# Altium schematic sheet DE-061116.SchDoc: Do Not Disturb Modul
size A4; Author: eldar6776@hotmail.com; DrawnBy: Eldar Dedic; Organization: I-MEDIA Group d.o.o; Address1: Topal Osman Paše 18; Address2: 71000 Sarajevo; Address3: Federacija BiH; Address4: Bosna i Hercegovina; DocumentNumber: DE-061116; Revision: 001; SheetNumber: 1; SheetTotal: 1; DocumentName: Do Not Disturb Hotel Modul; ProjectName: DE-061116
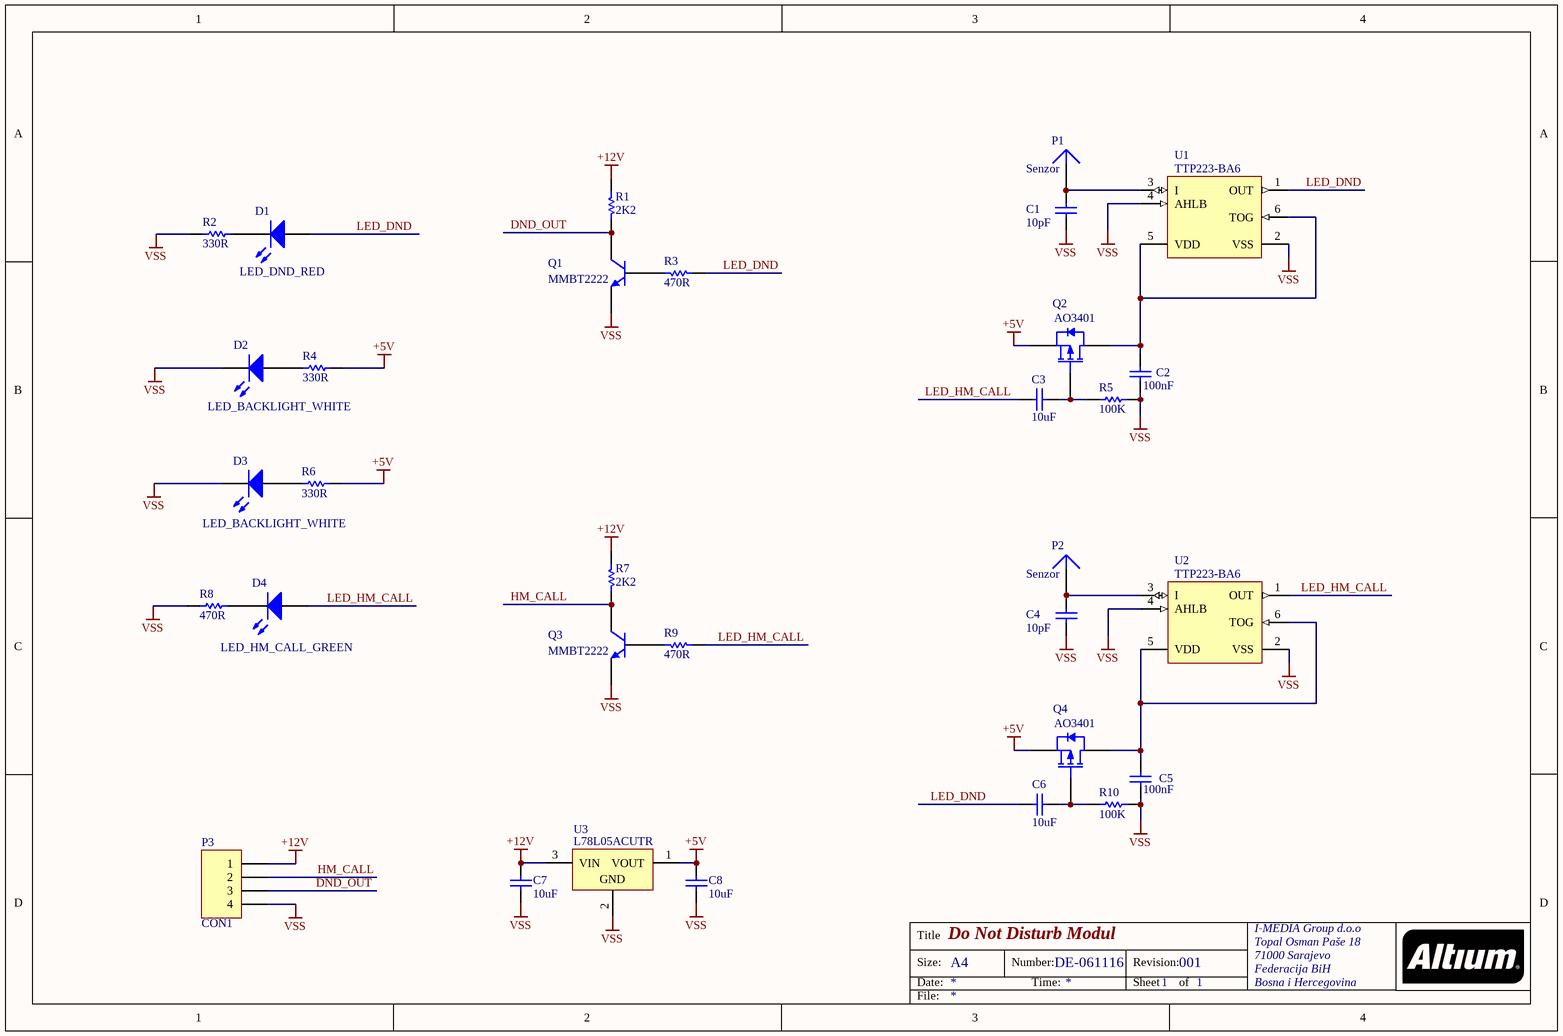
[diagram p0: DE-061116.SchDoc]

## Parts
C1  10pF  [0603]
C2  100nF  [0603]
C3  10uF  [0805]
C4  10pF  [0603]
C5  100nF  [0603]
C6  10uF  [0805]
C7  10uF  [0805]
C8  10uF  [0805]
D1  LED_DND_RED  [2.0X1.25X1.2]
D2  LED_BACKLIGHT_WHITE  [2.0X1.25X1.2]
D3  LED_BACKLIGHT_WHITE  [2.0X1.25X1.2]
D4  LED_HM_CALL_GREEN  [2.0X1.25X1.2]
P1  Senzor  [PIN1]
P2  Senzor  [PIN1]
P3  CON1  [HDR1X4]
Q1  MMBT2222  [SOT23_N]
Q2  AO3401  [SOT23_N]
Q3  MMBT2222  [SOT23_N]
Q4  AO3401  [SOT23_N]
R1  2K2  [ERA-0603]
R2  330R  [ERA-0603]
R3  470R  [ERA-0603]
R4  330R  [ERA-0603]
R5  100K  [ERA-0603]
R6  330R  [ERA-0603]
R7  2K2  [ERA-0603]
R8  470R  [ERA-0603]
R9  470R  [ERA-0603]
R10  100K  [ERA-0603]
U1  TTP223-BA6  [6ST1_N]
U2  TTP223-BA6  [6ST1_N]
U3  L78L05ACUTR  [SOT-89_N]

## Nets
+5V: C8.2 Q2.2(S) Q4.2(S) R4.1 R6.1 U3.1(VOUT)
+12V: C7.2 P3.1 R1.1 R7.1 U3.3(VIN)
VSS: C1.2 C2.1 C4.2 C5.1 C7.1 C8.1 D2.2(K) D3.2(K) P3.4 Q1.2(E) Q3.2(E) R2.2 R5.1 R8.2 R10.1 U1.2(VSS) U1.4(AHLB) U2.2(VSS) U2.4(AHLB) U3.2(GND)
DND_OUT: P3.3 Q1.3(C) R1.2
HM_CALL: P3.2 Q3.3(C) R7.2
LED_DND: C6.1 D1.1(A) R3.2 U1.1(OUT)
LED_HM_CALL: C3.1 D4.1(A) R9.2 U2.1(OUT)
NetC1_1: C1.1 P1.1 U1.3(I)
NetC2_2: C2.2 Q2.3(D) U1.5(VDD) U1.6(TOG)
NetC3_2: C3.2 Q2.1(G) R5.2
NetC4_1: C4.1 P2.1 U2.3(I)
NetC5_2: C5.2 Q4.3(D) U2.5(VDD) U2.6(TOG)
NetC6_2: C6.2 Q4.1(G) R10.2
NetD1_2: D1.2(K) R2.1
NetD2_1: D2.1(A) R4.2
NetD3_1: D3.1(A) R6.2
NetD4_2: D4.2(K) R8.1
NetQ1_1: Q1.1(B) R3.1
NetQ3_1: Q3.1(B) R9.1

## Notes on the sheet
- Title
- Size:
- Date:
- A4
- Number:
- Time:
- Revision:
- Sheet
- of
- File:

## Library data of the parts
C1 C4 = C0603: Ceramic Chip Capacitor - Standard; Note: Footprint corresponds to dimensions for bulk cassette packaging. This case size has tightened tolerances.; Value: 22pF; Published: 17-Jul-2002; LatestRevisionDate: 19-Mar-2004; LatestRevisionNote: Silkscreen size reduced.; DatasheetDocument: Mar-2001; PackageDocument: Mar-2001; PackageReference: 0603; Publisher: Altium Limited; Code_JEITA: 0603; Code_IPC: 1608 [0603]; ComponentLink1Description: Manufacturer Link; ComponentLink1URL: http://www.kemet.com/; ComponentLink2Description: Datasheet; ComponentLink2URL: http://www.kemet.com/kemet/web/homepage/kechome.nsf/vapubfilesname/F3102TA.pdf/$file/F3102TA.pdf
C2 C5 = C0603: Ceramic Chip Capacitor - Standard; Note: Footprint corresponds to dimensions for bulk cassette packaging. This case size has tightened tolerances.; Published: 17-Jul-2002; LatestRevisionDate: 19-Mar-2004; LatestRevisionNote: Silkscreen size reduced.; DatasheetDocument: Mar-2001; PackageDocument: Mar-2001; PackageReference: 0603; Publisher: Altium Limited; Code_JEITA: 0603; Code_IPC: 1608 [0603]; ComponentLink1Description: Manufacturer Link; ComponentLink1URL: http://www.kemet.com/; ComponentLink2Description: Datasheet; ComponentLink2URL: http://www.kemet.com/kemet/web/homepage/kechome.nsf/vapubfilesname/F3102TA.pdf/$file/F3102TA.pdf; Value: 100nF
C3 C6-C8 = C0805: Ceramic Chip Capacitor - Standard; Note: Footprint corresponds to dimensions for bulk cassette packaging. This case size has tightened tolerances.; Published: 17-Jul-2002; LatestRevisionDate: 19-Mar-2004; LatestRevisionNote: Silkscreen size reduced.; DatasheetDocument: Mar-2001; PackageDocument: Mar-2001; PackageReference: 0805; Publisher: Altium Limited; Code_JEITA: 0805; Code_IPC: 2012[0805]; ComponentLink1Description: Manufacturer Link; ComponentLink1URL: http://www.kemet.com/; ComponentLink2Description: Datasheet; ComponentLink2URL: http://www.kemet.com/kemet/web/homepage/kechome.nsf/vapubfilesname/F3102TA.pdf/$file/F3102TA.pdf; Value: 10uF
D1-D4 = HSMC-C540-F0001: Top Mount AS AlInGaP Red Oval Lens High Brightness; LuminousIntensity: 96mcd (Minimum).; PCB_Layout: Complies with manufacturer's recommendation.; Published: 11-Dec-2002; DatasheetDocument: 7-Mar-2002; PackageDocument: 30-Apr-2002; PackageReference: 2.0X1.25X1.2; Publisher: Altium Limited; LED_Colour: Red; ComponentLink1Description: Manufacturer Link; ComponentLink1URL: http://www.agilent.com/; ComponentLink2Description: Datasheet; ComponentLink2URL: http://cp.literature.agilent.com/litweb/pdf/5988-5794EN.pdf
P1 P2 = Plug: LatestRevisionDate: 17-Jul-2002; LatestRevisionNote: Re-released for DXP Platform.; Publisher: Altium Limited
P3 = Header 4: Header, 4-Pin; LatestRevisionDate: 17-Jul-2002; LatestRevisionNote: Re-released for DXP Platform.; Publisher: Altium Limited
Q1 Q3 = BC817: NPN General-purpose Transistor; Published: 17-Sep-2003; LatestRevisionDate: 12-Dec-2006; LatestRevisionNote: IPC-7351 Footprint Added.; DatasheetVersion: Jun-1999; PackageVersion: May-1999; PackageReference: SOT23; Publisher: Altium Limited; PackageDescription: 3-Pin SOT-23 Package 0.95 mm Pitch, 2.3 mm Lead Span; ComponentLink1Description: Manufacturer Link; ComponentLink1URL: http://www.semiconductors.philips.com/; ComponentLink2Description: Datasheet; ComponentLink2URL: http://www.semiconductors.philips.com/acrobat/datasheets/BC817_BC817W_BC337_5.pdf
Q2 Q4 = BSH205: P-channel Enhancement Mode MOSFET; Published: 17-Sep-2003; LatestRevisionDate: 12-Dec-2006; LatestRevisionNote: IPC-7351 Footprint Added.; DatasheetVersion: Aug-1998; PackageVersion: May-1999; PackageReference: SOT23; Publisher: Altium Limited; PackageDescription: 3-Pin SOT-23 Package 0.95 mm Pitch, 2.3 mm Lead Span; ComponentLink1Description: Manufacturer Link; ComponentLink1URL: http://www.semiconductors.philips.com/; ComponentLink2Description: Datasheet; ComponentLink2URL: http://www.semiconductors.philips.com/acrobat/datasheets/BSH205_3.pdf
R1-R10 = ERAV: Metal Film Thermosensitive Chip Resistor, 0.56 Ohm to 10k Ohm Range, 5% Tolerance, 0603 Size, 0.063 W; Note: If flow soldering, adjust pad width of PCB Footprint to 0.7 - 0.8 times the width of the resistor.; Published: 17-Dec-2003; LatestRevisionDate: 19-Mar-2004; LatestRevisionNote: Silkscreen size reduced.; PackageDocument: Mar-2003; PackageReference: ERA-0603; Publisher: Altium Limited; Code_IPC: 1608 [0603]; ComponentLink1Description: Manufacturer Link; ComponentLink1URL: http://www.panasonic.com/industrial/components/resistive_products.htm; ComponentLink2Description: Datasheet; ComponentLink2URL: http://www.panasonic.com/industrial/components/pdf/AOF0000CE1.pdf
U1 U2 = AT42QT1012: One-channel Toggle-mode Touch Sensor IC with Power Management Functions, 6-pin SOT23; Published: 1-Apr-2010; DatasheetVersion: revCS, Feb-2010; PackageVersion: revA, Jun-2008; PackageReference: 6ST1; Publisher: Altium Limited; PackageDescription: 6-Lead, 2.90 x 1.60 mm Plastic Small Outline Package (SOT23); Code_JEDEC: MO-178-AB; Code_IPC: SOT26A-6; ComponentLink1Description: Manufacturer Link; ComponentLink1URL: http://www.atmel.com/products/overview_touch.asp?; ComponentLink2Description: AT42QT1012 Summary; ComponentLink2URL: http://www.atmel.com/dyn/resources/prod_documents/9543S.pdf; ComponentLink3Description: Atmel.com Home; ComponentLink3URL: http://www.atmel.com
U3 = L78L05ACUTR: Positive Voltage Regulator, 5V, 4-Pin SOT-89, Tape and Reel; DatasheetVersion: Feb-2011; PackageVersion: 2011; PackageReference: SOT-89; PackageDescription: 3-Pin SOT-89 Package 1.5 mm Pitch, 4.1 mm Lead Span; PartNumber: L78L05ACUTR; ComponentLink1Description: Manufacturer URL; ComponentLink1URL: http://www.st.com; ComponentLink2Description: Datasheet; ComponentLink2URL: http://www.st.com/internet/com/TECHNICAL_RESOURCES/TECHNICAL_LITERATURE/DATASHEET/CD00000446.pdf